# Altium project IR_Communication.PrjPcb
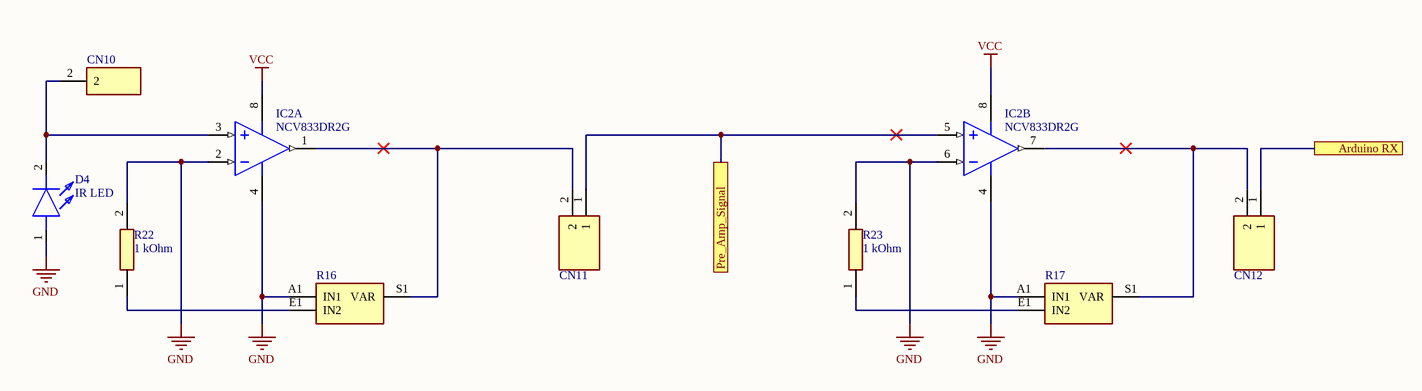
[diagram p0: Pre_Amplifier.SchDoc]
5 sheets, 58 parts. Net scope: flat (ports and power ports of the same name join across sheets).
Board file: IR_Communication.PcbDoc
Sheets:
  Pre_Amplifier.SchDoc
  Amplifier.SchDoc
  Indicators.SchDoc
  Input_Selection.SchDoc
  CPU.SchDoc

## Sheet Pre_Amplifier.SchDoc: Pre Amplifier
size A4; DrawnBy: Sem Kirkels; DocumentNumber: 22-23P01S01; Revision: V1; SheetNumber: 1; SheetTotal: 5

### Parts
CN10  1 Pin Header  [1 PIN HEADER]  (value not drawn)
CN11  2 Pin Header  [2 Pin Header]  (value not drawn)
CN12  2 Pin Header  [2 Pin Header]  (value not drawn)
D4  IR LED  [ELIR204H16L10]
IC2  NCV833DR2G  [Footprint Opamp]  (parts A,B of 2)
R16  PT10LV10-202A2020-S  [Variable resistor]  (value not drawn)
R17  PT10LV10-202A2020-S  [Variable resistor]  (value not drawn)
R22  1 kOhm  [0805]
R23  1 kOhm  [0805]

### Ports
Arduino RX (see CPU[2B]), Pre_Amp_Signal (see Amplifier[1A], Amplifier[1C], Amplifier[2A], Amplifier[2C])

### Nets
GND: D4.1(A) IC2.2(IN1-) IC2.4(VEE) IC2.6(IN2-) R16.A1(IN1) R17.A1(IN1) R22.2 R23.2
VCC: IC2.8(VCC)
NetCN6_2: CN12.1 ; port Arduino RX
NetCN10_2: CN10.2 D4.2(K) IC2.3(IN1+)
NetCN11_1: CN11.1 IC2.5(IN2+) ; port Pre_Amp_Signal
NetCN11_2: CN11.2 IC2.1(OUT1) R16.S1(VAR)
NetCN12_2: CN12.2 IC2.7(OUT2) R17.S1(VAR)
NetR16_E1: R16.E1(IN2) R22.1
NetR17_E1: R17.E1(IN2) R23.1

### Library data of the parts
CN10 = 1 Pin Header: Connector; Manufacturer_Name: TE Connectivity; Manufacturer_Part_Number: 5-146281-1; Datasheet Link: https://www.mouser.com/datasheet/2/418/NG_CD_146281_G1-1238634.pdf; Height: 8.81mm; Mouser Part Number: 571-5-146281-1; Mouser Price/Stock: https://www.mouser.co.uk/ProductDetail/TE-Connectivity/5-146281-1?qs=bwpFY26eRVdQbbdvDiYEig%3D%3D; Arrow Part Number: 5-146281-1; Arrow Price/Stock: https://www.arrow.com/en/products/5-146281-1/te-connectivity
CN11 CN12 = 2 Pin Header: Connector; Manufacturer_Name: TE Connectivity; Manufacturer_Part_Number: 5-146284-2; Datasheet Link: https://componentsearchengine.com/Datasheets/1/5-146284-2.pdf; Height: 8.21mm; Mouser Part Number: 571-5-146284-2; Mouser Price/Stock: https://www.mouser.co.uk/ProductDetail/TE-Connectivity/5-146284-2?qs=26tC0AmtfJgTF4M3cEQgiA%3D%3D; Arrow Part Number: 5-146284-2; Arrow Price/Stock: https://www.arrow.com/en/products/5-146284-2/te-connectivity
D4 = IR LED: LED EL-IR204_H16_L10; Manufacturer_Name: Everlight; Manufacturer_Part_Number: EL-IR204/H16/L10; Datasheet Link: https://www.mouser.de/ProductDetail/Everlight/EL-IR204-H16-L10?qs=vs%252BWWTB4QKYLfZ6uf%2Fu%252B0Q%3D%3D; Height: 7mm; Mouser Part Number: 638-IR204/H16/L10; Mouser Price/Stock: https://www.mouser.co.uk/ProductDetail/Everlight/EL-IR204-H16-L10?qs=vs%252BWWTB4QKYLfZ6uf%2Fu%252B0Q%3D%3D
IC2 = Opamp: Low Noise, Audio Dual Operational Amplifier, -40 to 85 degC, 8-Pin SOIC, Pb-Free, Tape and Reel; Manufacturer: On Semiconductor; SR Typ (V/uS): 7; GBW Typ (MHz): 15; RoHS: TRUE; ComponentLink2URL: http://www.onsemi.cn/pub_link/Collateral/LM833-D.PDF; ComponentLink1Description: Manufacturer URL; ComponentLink3Description: Package Specification; Mounting Technology: Surface Mount; Packing: Tape and Reel; ComponentLink3URL: http://www.onsemi.com/pub_link/Collateral/751-07.PDF; DatasheetVersion: Rev. 6; ComponentLink1URL: http://www.onsemi.com/; PackageDescription: 8-Pin Small Outline Integrated Circuit, Body 4.9 x 3.9 mm, Pitch 1.27 mm; PackageReference: SOIC-8-751-07; PartNumber: NCV833DR2G; PackageVersion: Rev. AK, 02/2011; ComponentLink2Description: Datasheet
R16 R17 = PT10LV10-202A2020-S: Variable Resistor; Manufacturer_Name: PIHER; Datasheet Link: https://www.piher.net/pdf/12-PT10v03.pdf; Height: 6.2mm; Manufacturer_Part_Number: PT10LV10-202A2020-S; Mouser Part Number: 531-PT10V-2K-S; Mouser Price/Stock: https://www.mouser.co.uk/ProductDetail/Amphenol-Piher/PT10LV10-202A2020-S?qs=pCZPOPZMYPhb8H8I5oW3PQ%3D%3D
R22 R23 = Resistor: Manufacturer_Name: YAGEO; Manufacturer_Part_Number: RP0805BRD071KL; Datasheet Link: https://www.yageo.com/upload/media/product/products/datasheet/rchip/PYu-RP_51_RoHS_L_0.pdf; Height: 0.6mm; Mouser Part Number: 603-RP0805BRD071KL; Mouser Price/Stock: https://www.mouser.co.uk/ProductDetail/YAGEO/RP0805BRD071KL?qs=Y0Uzf4wQF3m8mAbG54g63Q%3D%3D

## Sheet Amplifier.SchDoc: Amplifier
size A4; DrawnBy: Sem Kirkels; DocumentNumber: 22-23P01S02; Revision: V1; SheetNumber: 2; SheetTotal: 5
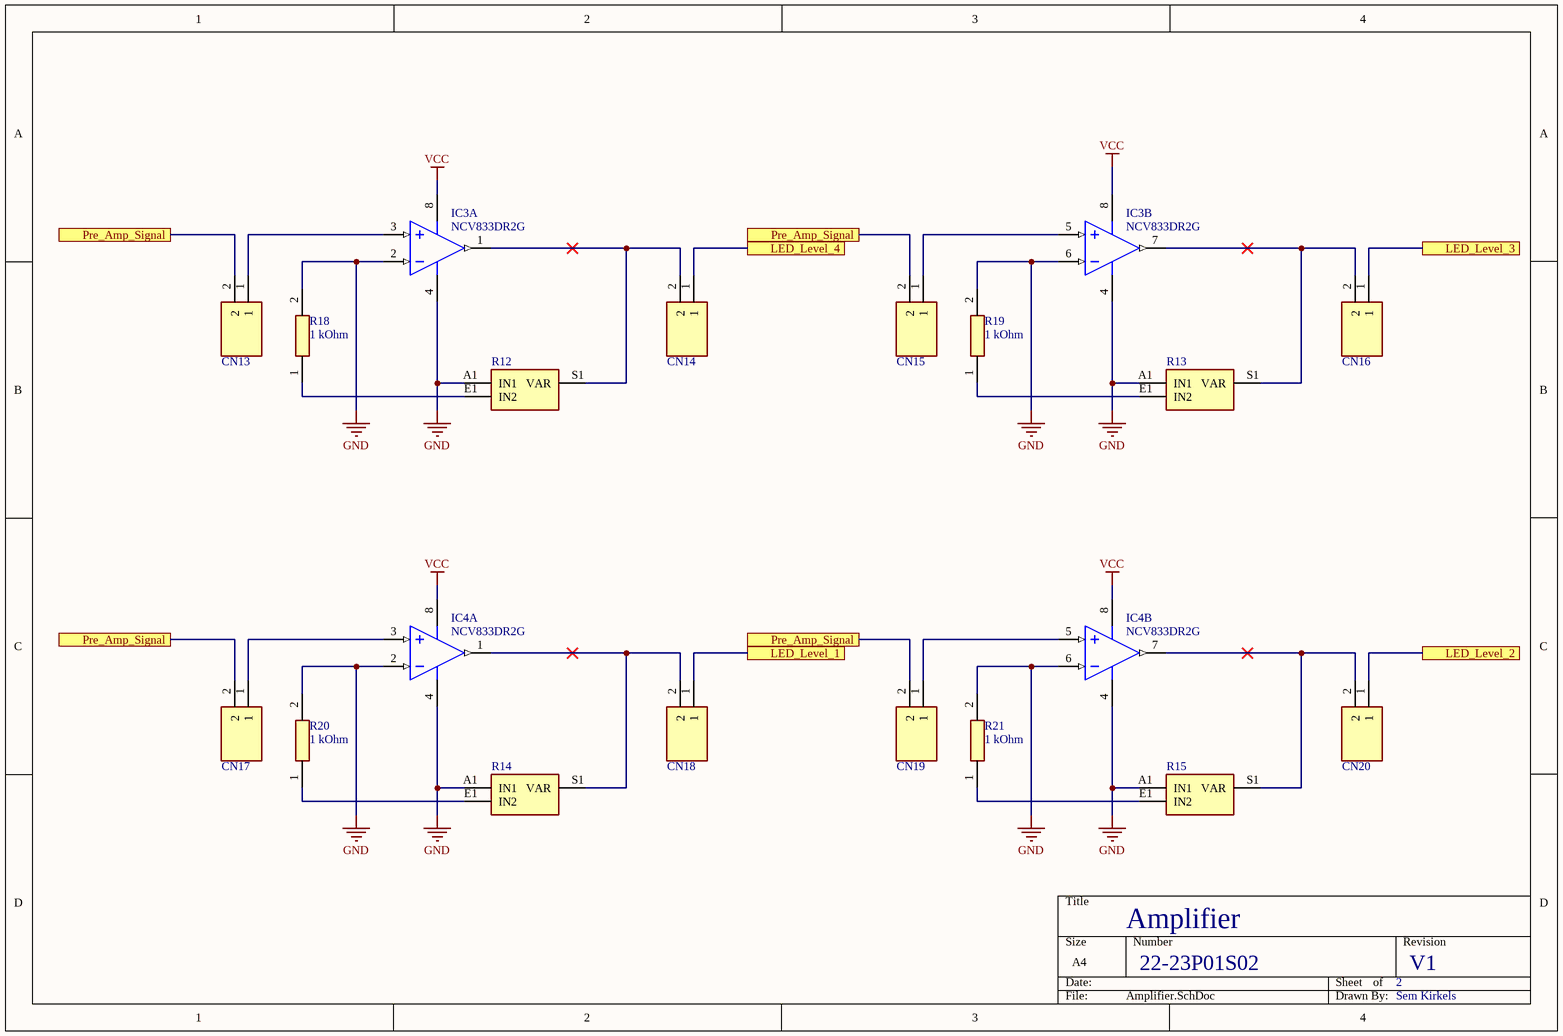
[diagram p1: Amplifier.SchDoc]

### Parts
CN13  2 Pin Header  [2 Pin Header]  (value not drawn)
CN14  2 Pin Header  [2 Pin Header]  (value not drawn)
CN15  2 Pin Header  [2 Pin Header]  (value not drawn)
CN16  2 Pin Header  [2 Pin Header]  (value not drawn)
CN17  2 Pin Header  [2 Pin Header]  (value not drawn)
CN18  2 Pin Header  [2 Pin Header]  (value not drawn)
CN19  2 Pin Header  [2 Pin Header]  (value not drawn)
CN20  2 Pin Header  [2 Pin Header]  (value not drawn)
IC3  NCV833DR2G  [Footprint Opamp]  (parts A,B of 2)
IC4  NCV833DR2G  [Footprint Opamp]  (parts A,B of 2)
R12  PT10LV10-202A2020-S  [Variable resistor]  (value not drawn)
R13  PT10LV10-202A2020-S  [Variable resistor]  (value not drawn)
R14  PT10LV10-202A2020-S  [Variable resistor]  (value not drawn)
R15  PT10LV10-202A2020-S  [Variable resistor]  (value not drawn)
R18  1 kOhm  [0805]
R19  1 kOhm  [0805]
R20  1 kOhm  [0805]
R21  1 kOhm  [0805]

### Ports
LED_Level_1 (see Indicators[2B]), LED_Level_2 (see Indicators[2B]), LED_Level_3 (see Indicators[2B]), LED_Level_4 (see Indicators[2B]), Pre_Amp_Signal (see Amplifier[1A], Amplifier[1C], Amplifier[2A], Pre_Amplifier[3B]), Pre_Amp_Signal (see Amplifier[1A], Amplifier[1C], Amplifier[2C], Pre_Amplifier[3B]), Pre_Amp_Signal (see Amplifier[1A], Amplifier[2A], Amplifier[2C], Pre_Amplifier[3B]), Pre_Amp_Signal (see Amplifier[1C], Amplifier[2A], Amplifier[2C], Pre_Amplifier[3B])

### Nets
GND: IC3.2(IN1-) IC3.4(VEE) IC3.6(IN2-) IC4.2(IN1-) IC4.4(VEE) IC4.6(IN2-) R12.A1(IN1) R13.A1(IN1) R14.A1(IN1) R15.A1(IN1) R18.2 R19.2 R20.2 R21.2
VCC: IC3.8(VCC) IC4.8(VCC)
NetCN11_1: CN13.2 CN15.2 CN17.2 CN19.2 ; port Pre_Amp_Signal
NetCN13_1: CN13.1 IC3.3(IN1+)
NetCN14_1: CN14.1 ; port LED_Level_4
NetCN14_2: CN14.2 IC3.1(OUT1) R12.S1(VAR)
NetCN15_1: CN15.1 IC3.5(IN2+)
NetCN16_1: CN16.1 ; port LED_Level_3
NetCN16_2: CN16.2 IC3.7(OUT2) R13.S1(VAR)
NetCN17_1: CN17.1 IC4.3(IN1+)
NetCN18_1: CN18.1 ; port LED_Level_1
NetCN18_2: CN18.2 IC4.1(OUT1) R14.S1(VAR)
NetCN19_1: CN19.1 IC4.5(IN2+)
NetCN20_1: CN20.1 ; port LED_Level_2
NetCN20_2: CN20.2 IC4.7(OUT2) R15.S1(VAR)
NetR12_E1: R12.E1(IN2) R18.1
NetR13_E1: R13.E1(IN2) R19.1
NetR14_E1: R14.E1(IN2) R20.1
NetR15_E1: R15.E1(IN2) R21.1

### Library data of the parts
CN13-CN20 = 2 Pin Header: as CN11 on sheet Pre_Amplifier; Datasheet Link: https://componentsearchengine.com/Datasheets/1/5-146284-2.pdf; Height: 8.21mm; Mouser Part Number: 571-5-146284-2; Mouser Price/Stock: https://www.mouser.co.uk/ProductDetail/TE-Connectivity/5-146284-2?qs=26tC0AmtfJgTF4M3cEQgiA%3D%3D; Arrow Part Number: 5-146284-2; Arrow Price/Stock: https://www.arrow.com/en/products/5-146284-2/te-connectivity
IC3 IC4 = Opamp: as IC2 on sheet Pre_Amplifier; RoHS: TRUE; ComponentLink2URL: http://www.onsemi.cn/pub_link/Collateral/LM833-D.PDF; ComponentLink1Description: Manufacturer URL; ComponentLink3Description: Package Specification; Mounting Technology: Surface Mount; Packing: Tape and Reel; ComponentLink3URL: http://www.onsemi.com/pub_link/Collateral/751-07.PDF; DatasheetVersion: Rev. 6; ComponentLink1URL: http://www.onsemi.com/; PackageDescription: 8-Pin Small Outline Integrated Circuit, Body 4.9 x 3.9 mm, Pitch 1.27 mm; PackageReference: SOIC-8-751-07; PartNumber: NCV833DR2G; PackageVersion: Rev. AK, 02/2011; ComponentLink2Description: Datasheet
R12-R15 = PT10LV10-202A2020-S: as R16 on sheet Pre_Amplifier; Datasheet Link: https://www.piher.net/pdf/12-PT10v03.pdf; Height: 6.2mm; Manufacturer_Part_Number: PT10LV10-202A2020-S; Mouser Part Number: 531-PT10V-2K-S; Mouser Price/Stock: https://www.mouser.co.uk/ProductDetail/Amphenol-Piher/PT10LV10-202A2020-S?qs=pCZPOPZMYPhb8H8I5oW3PQ%3D%3D
R18-R21 = Resistor: as R22 on sheet Pre_Amplifier; Datasheet Link: https://www.yageo.com/upload/media/product/products/datasheet/rchip/PYu-RP_51_RoHS_L_0.pdf; Height: 0.6mm; Mouser Part Number: 603-RP0805BRD071KL; Mouser Price/Stock: https://www.mouser.co.uk/ProductDetail/YAGEO/RP0805BRD071KL?qs=Y0Uzf4wQF3m8mAbG54g63Q%3D%3D

## Sheet Indicators.SchDoc: Indicators
size A4; DrawnBy: Sem Kirkels; DocumentNumber: 22-23P01S03; Revision: V1; SheetNumber: 3; SheetTotal: 5
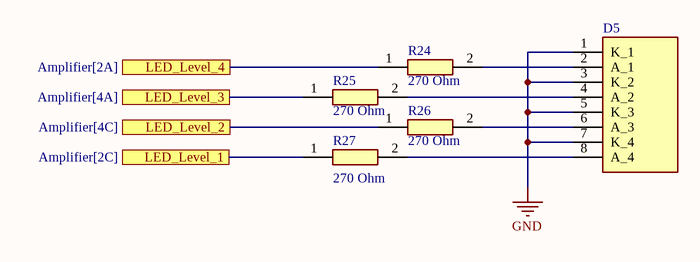
[diagram p2: Indicators.SchDoc]

### Parts
D5  LED Bar  [LED_Bar]  (value not drawn)
R24  270 Ohm  [0805]
R25  270 Ohm  [0805]
R26  270 Ohm  [0805]
R27  270 Ohm  [0805]

### Ports
LED_Level_1 (see Amplifier[2C]), LED_Level_2 (see Amplifier[4C]), LED_Level_3 (see Amplifier[4A]), LED_Level_4 (see Amplifier[2A])

### Nets
GND: D5.1(K_1) D5.3(K_2) D5.5(K_3) D5.7(K_4)
NetCN14_1: R24.1 ; port LED_Level_4
NetCN16_1: R25.1 ; port LED_Level_3
NetCN18_1: R27.1 ; port LED_Level_1
NetCN20_1: R26.1 ; port LED_Level_2
NetD5_2: D5.2(A_1) R24.2
NetD5_4: D5.4(A_2) R25.2
NetD5_6: D5.6(A_3) R26.2
NetD5_8: D5.8(A_4) R27.2

### Library data of the parts
D5 = LED Bar: SSB-LX2550SGW; Manufacturer_Name: Lumex; Datasheet Link: https://www.mouser.fr/datasheet/2/244/SSB-LX2550SGW-1777056.pdf; Height: 7.37mm; Manufacturer_Part_Number: SSB-LX2550SGW; Mouser Part Number: 696-SSB-LX2550SGW; Mouser Price/Stock: https://www.mouser.co.uk/ProductDetail/Lumex/SSB-LX2550SGW?qs=K%252Bxkc0srH7Bp%252B5yK7Wnd0w%3D%3D
R24-R27 = Resistor: as R22 on sheet Pre_Amplifier; Datasheet Link: https://www.yageo.com/upload/media/product/products/datasheet/rchip/PYu-RP_51_RoHS_L_0.pdf; Height: 0.6mm; Mouser Part Number: 603-RP0805BRD071KL; Mouser Price/Stock: https://www.mouser.co.uk/ProductDetail/YAGEO/RP0805BRD071KL?qs=Y0Uzf4wQF3m8mAbG54g63Q%3D%3D

## Sheet Input_Selection.SchDoc: Input Selection
size A4; DrawnBy: Sem Kirkels; DocumentNumber: 22-23P01S04; Revision: V1; SheetNumber: 4; SheetTotal: 5
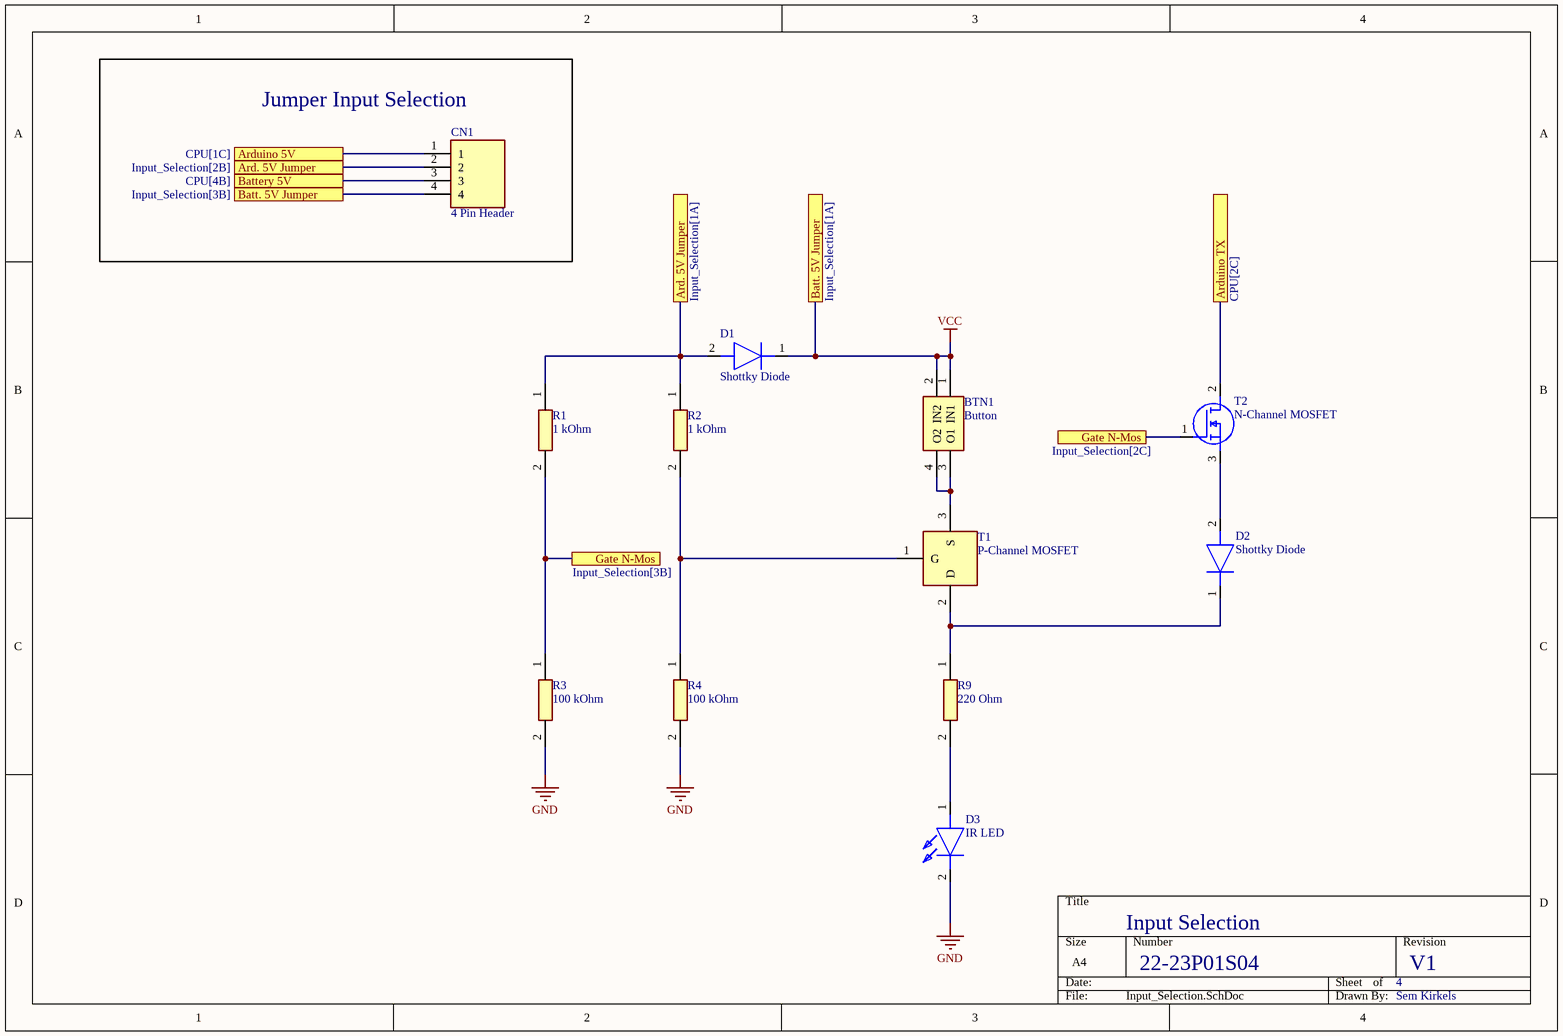
[diagram p3: Input_Selection.SchDoc]

### Parts
BTN1  Button  [PushButton]
CN1  4 Pin Header  [4 PIN HEADER]
D1  Shottky Diode  [Zener Diode]
D2  Shottky Diode  [Zener Diode]
D3  IR LED  [ELIR204H16L10]
R1  1 kOhm  [0805]
R2  1 kOhm  [0805]
R3  100 kOhm  [0805]
R4  100 kOhm  [0805]
R9  220 Ohm  [0805]
T1  P-Channel MOSFET  [TO254P469X1042X1967-3P]
T2  N-Channel MOSFET  [N-MOS]

### Blocks framed on the sheet
Jumper Input Selection: CN1

### Ports
Ard. 5V Jumper (see Input_Selection[1A]), Ard. 5V Jumper (see Input_Selection[2B]), Arduino 5V (see CPU[1C]), Arduino TX (see CPU[2C]), Batt. 5V Jumper (see Input_Selection[1A]), Batt. 5V Jumper (see Input_Selection[3B]), Battery 5V (see CPU[4B]), Gate N-Mos (see Input_Selection[2C]), Gate N-Mos (see Input_Selection[3B])

### Nets
GND: D3.2(K) R3.2 R4.2
VCC: BTN1.1(IN1) BTN1.2(IN2) CN1.4 D1.1(K) ; port Batt. 5V Jumper
NetBTN1_3: BTN1.3(O1) BTN1.4(O2) T1.3(S)
NetCN1_1: CN1.1 ; port Arduino 5V
NetCN1_2: CN1.2 D1.2(A) R1.1 R2.1 ; port Ard. 5V Jumper
NetCN1_3: CN1.3 ; port Battery 5V
NetCN5_2: T2.2(D) ; port Arduino TX
NetD2_1: D2.1(K) R9.1 T1.2(D)
NetD2_2: D2.2(A) T2.3(S)
NetD3_1: D3.1(A) R9.2
NetR1_2: R1.2 R3.1 T2.1(G) ; port Gate N-Mos
NetR2_2: R2.2 R4.1 T1.1(G)

### Library data of the parts
BTN1 = Button: TS02-66-50-BK-100-SCR-D; Manufacturer_Name: CUI Devices; Datasheet Link: https://www.cuidevices.com/product/resource/ts02.pdf; Height: 5.2mm; Manufacturer_Part_Number: TS02-66-50-BK-100-SCR-D; Mouser Part Number: 179-TS026650BK100SCR; Mouser Price/Stock: https://www.mouser.co.uk/ProductDetail/CUI-Devices/TS02-66-50-BK-100-SCR-D?qs=A6eO%252BMLsxmQON%252BZSzpek2A%3D%3D; Arrow Part Number: TS02-66-50-BK-100-SCR-D; Arrow Price/Stock: https://www.arrow.com/en/products/ts02-66-50-bk-100-scr-d/cui-devices?region=nac
CN1 = 4 Pin Header: G800LW304032EU; Manufacturer_Name: Amphenol Communications Solutions; Datasheet Link: https://cdn.amphenol-cs.com/media/wysiwyg/files/drawing/g800lwxxxxxxeu.pdf; Height: 8.63mm; Manufacturer_Part_Number: G800LW304032EU; Mouser Part Number: 523-G800LW304032EU; Mouser Price/Stock: https://www.mouser.com/Search/Refine.aspx?Keyword=523-G800LW304032EU
D1 D2 = Zener Diode: VS-10BQ015-M3_5BT; Manufacturer_Name: Vishay; Manufacturer_Part_Number: VS-10BQ015-M3/5BT; Datasheet Link: https://componentsearchengine.com/Datasheets/2/VS-10BQ015-M3_5BT.pdf; Height: 2.44mm; Mouser Part Number: 78-VS-10BQ015-M35BT; Mouser Price/Stock: https://www.mouser.co.uk/ProductDetail/Vishay-Semiconductors/VS-10BQ015-M3-5BT?qs=asPD7ZL2j3VpzaHhlDLLKA%3D%3D; Arrow Part Number: VS-10BQ015-M3/5BT; Arrow Price/Stock: https://www.arrow.com/en/products/vs-10bq015-m35bt/vishay
D3 = IR LED: as D4 on sheet Pre_Amplifier; Datasheet Link: https://www.mouser.de/ProductDetail/Everlight/EL-IR204-H16-L10?qs=vs%252BWWTB4QKYLfZ6uf%2Fu%252B0Q%3D%3D; Height: 7mm; Mouser Part Number: 638-IR204/H16/L10; Mouser Price/Stock: https://www.mouser.co.uk/ProductDetail/Everlight/EL-IR204-H16-L10?qs=vs%252BWWTB4QKYLfZ6uf%2Fu%252B0Q%3D%3D
R1-R4 R9 = Resistor: as R22 on sheet Pre_Amplifier; Datasheet Link: https://www.yageo.com/upload/media/product/products/datasheet/rchip/PYu-RP_51_RoHS_L_0.pdf; Height: 0.6mm; Mouser Part Number: 603-RP0805BRD071KL; Mouser Price/Stock: https://www.mouser.co.uk/ProductDetail/YAGEO/RP0805BRD071KL?qs=Y0Uzf4wQF3m8mAbG54g63Q%3D%3D
T1 = P-Channel MOSFET: MOSFET (P-Channel)IRF9530NPBF; Manufacturer_Name: Infineon; Datasheet Link: https://www.infineon.com/dgdl/irf9530npbf.pdf?fileId=5546d462533600a401535611b9931dc1; Height: 4.69mm; Manufacturer_Part_Number: IRF9530NPBF; Mouser Part Number: 942-IRF9530NPBF; Mouser Price/Stock: https://www.mouser.co.uk/ProductDetail/Infineon-Technologies/IRF9530NPBF?qs=9%252BKlkBgLFf2oWmEcBf5aZQ%3D%3D; Arrow Part Number: IRF9530NPBF; Arrow Price/Stock: https://www.arrow.com/en/products/irf9530npbf/infineon-technologies-ag?region=europe
T2 = N-Channel MOSFET: MOSFET (N-Channel)IRF540NPBF; Manufacturer_Name: Infineon; Datasheet Link: https://www.infineon.com/dgdl/irf540n.pdf?fileId=5546d462533600a4015355e396cb199f; Height: 4.69mm; Manufacturer_Part_Number: IRF540NPBF; Mouser Part Number: 942-IRF540NPBF; Mouser Price/Stock: https://www.mouser.co.uk/ProductDetail/Infineon-Technologies/IRF540NPBF?qs=9%252BKlkBgLFf36us%252Bg5kwffA%3D%3D; Arrow Part Number: IRF540NPBF; Arrow Price/Stock: https://www.arrow.com/en/products/irf540npbf/infineon-technologies-ag?region=europe

## Sheet CPU.SchDoc: CPU
size A4; DrawnBy: Axel Vanherle, Nathan Bruggeman; DocumentNumber: 22-23P01S05; Revision: V1; SheetNumber: 5; SheetTotal: 5
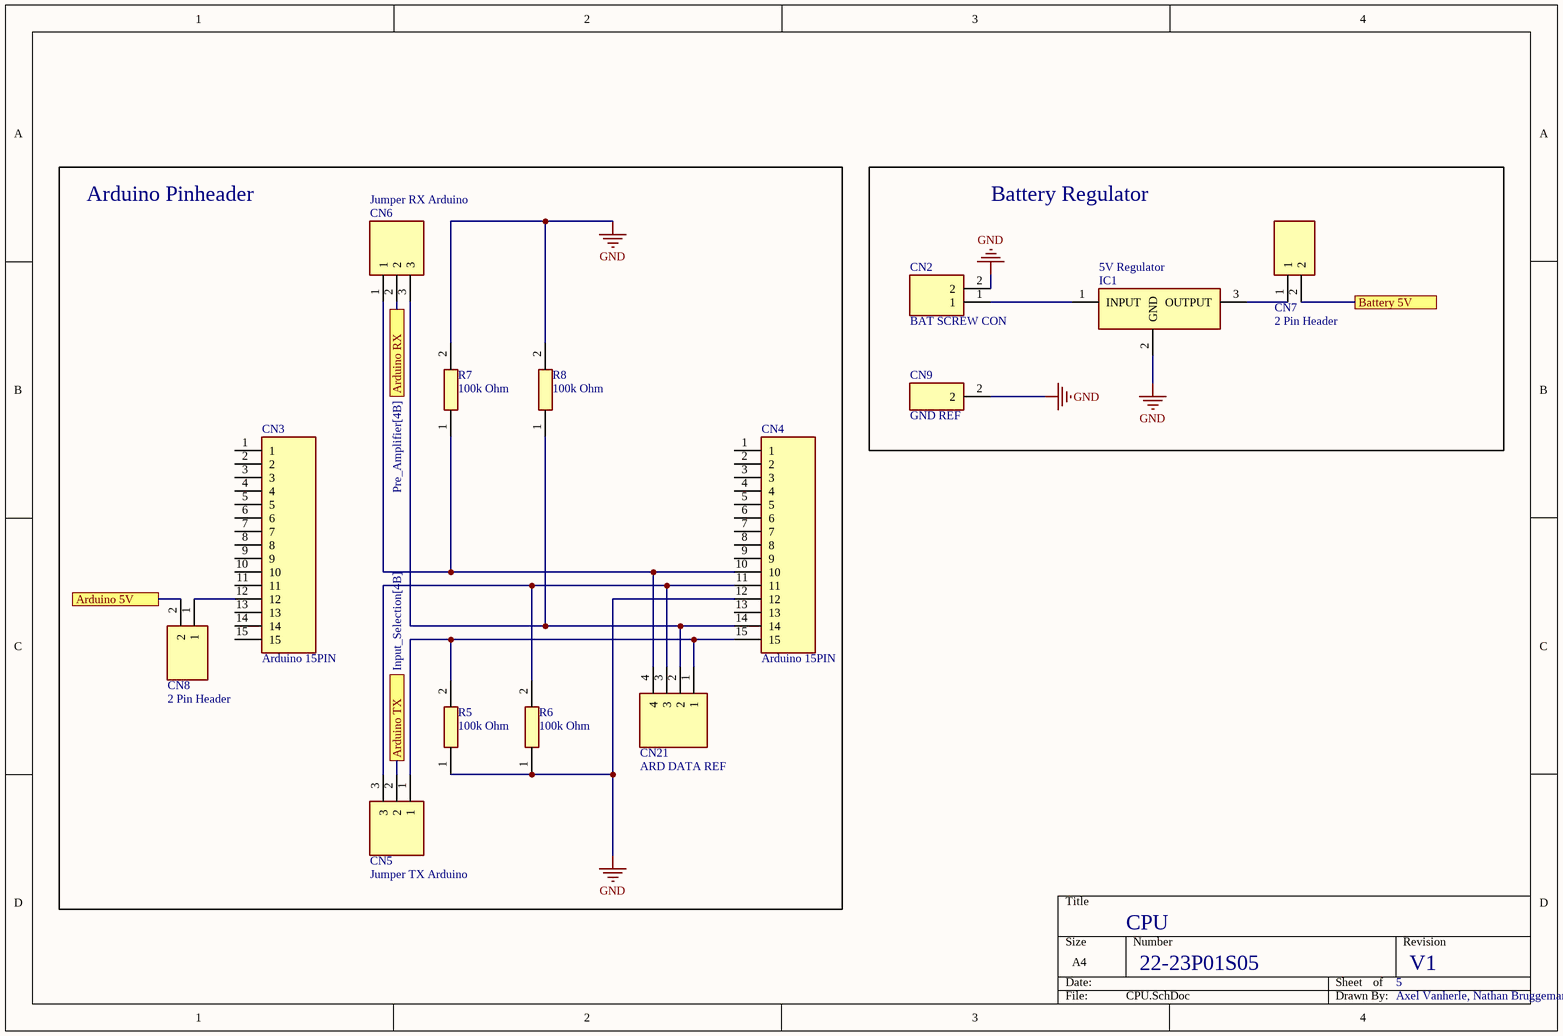
[diagram p4: CPU.SchDoc]

### Parts
CN2  BAT SCREW CON  [BAT SCREW CON]
CN3  Arduino 15PIN  [15 Pin Header]
CN4  Arduino 15PIN  [15 Pin Header]
CN5  Jumper TX Arduino  [3 Pin Header]
CN6  Jumper RX Arduino  [3 Pin Header]
CN7  2 Pin Header  [2 Pin Header]
CN8  2 Pin Header  [2 Pin Header]
CN9  GND REF  [1 PIN HEADER]
CN21  ARD DATA REF  [4 PIN HEADER]
IC1  5V Regulator  [5V Regulator]
R5  100k Ohm  [0805]
R6  100k Ohm  [0805]
R7  100k Ohm  [0805]
R8  100k Ohm  [0805]

### Blocks framed on the sheet
Arduino Pinheader: CN3-CN6 CN8 CN21 R5-R8
Battery Regulator: CN2 CN7 CN9 IC1

### Ports
Arduino 5V (see Input_Selection[1A]), Arduino RX (see Pre_Amplifier[4B]), Arduino TX (see Input_Selection[4B]), Battery 5V (see Input_Selection[1A])

### Nets
GND: CN2.2 CN4.12 CN9.2 IC1.2(GND) R5.1 R6.1 R7.2 R8.2
NetCN1_1: CN8.2 ; port Arduino 5V
NetCN1_3: CN7.2 ; port Battery 5V
NetCN2_1: CN2.1 IC1.1(INPUT)
NetCN3_12: CN3.12 CN8.1
NetCN4_10: CN4.10 CN6.1 CN21.4 R7.1
NetCN4_11: CN4.11 CN5.3 CN21.3 R6.2
NetCN4_14: CN4.14 CN6.3 CN21.2 R8.1
NetCN4_15: CN4.15 CN5.1 CN21.1 R5.2
NetCN5_2: CN5.2 ; port Arduino TX
NetCN6_2: CN6.2 ; port Arduino RX
NetCN7_1: CN7.1 IC1.3(OUTPUT)

Not connected (* = marked no-connect by the designer): CN3 1 2 3 4 5 6 7 8 9 10 11 13 14 15; CN4 1 2 3 4 5 6 7 8 9 13

### Library data of the parts
CN2 = BAT SCREW CON: Connector; Manufacturer_Name: CUI Devices; Manufacturer_Part_Number: TB006-508-02BE; Datasheet Link: https://datasheet.datasheetarchive.com/originals/distributors/Datasheets_SAMA/b266c411a02422edb513b788238f8420.pdf; Height: 10.4mm; Mouser Part Number: 490-TB006-508-02BE; Mouser Price/Stock: https://www.mouser.co.uk/ProductDetail/CUI-Devices/TB006-508-02BE?qs=vLWxofP3U2wEdOVV%2FaT04w%3D%3D; Arrow Part Number: TB006-508-02BE; Arrow Price/Stock: https://www.arrow.com/en/products/tb006-508-02be/cui-devices?region=nac
CN3 CN4 = 15 Pin Header: 15 Pin Header Connector; Manufacturer_Name: SparkFun; Manufacturer_Part_Number: PRT-16279; Datasheet Link: https://cdn.sparkfun.com/assets/8/d/8/4/7/DS-16279-Arduino_Nano_Stackable_Header_Kit.pdf; Height: 8.65mm; Mouser Part Number: 474-PRT-16279; Mouser Price/Stock: https://www.mouser.co.uk/ProductDetail/SparkFun/PRT-16279?qs=vmHwEFxEFR8I6W1vfufYPg%3D%3D; Arrow Part Number: PRT-16279; Arrow Price/Stock: https://www.arrow.com/en/products/prt-16279/sparkfun-electronics?region=nac
CN5 CN6 = 3 Pin Header: TSW-103-07-G-S; Manufacturer_Name: SAMTEC; Datasheet Link: http://suddendocs.samtec.com/prints/tsw-xxx-xx-xxx-x-xx-xxx-mkt.pdf; Manufacturer_Part_Number: TSW-103-07-G-S; Mouser Part Number: 200-TSW10307GS; Mouser Price/Stock: https://www.mouser.co.uk/ProductDetail/Samtec/TSW-103-07-G-S?qs=iT52DjcXudtntd1jApTIAw%3D%3D; Arrow Part Number: TSW-103-07-G-S; Arrow Price/Stock: https://www.arrow.com/en/products/tsw-103-07-g-s/samtec?region=europe
CN7 CN8 = 2 Pin Header: as CN11 on sheet Pre_Amplifier; Datasheet Link: https://componentsearchengine.com/Datasheets/1/5-146284-2.pdf; Height: 8.21mm; Mouser Part Number: 571-5-146284-2; Mouser Price/Stock: https://www.mouser.co.uk/ProductDetail/TE-Connectivity/5-146284-2?qs=26tC0AmtfJgTF4M3cEQgiA%3D%3D; Arrow Part Number: 5-146284-2; Arrow Price/Stock: https://www.arrow.com/en/products/5-146284-2/te-connectivity
CN9 = 1 Pin Header: as CN10 on sheet Pre_Amplifier; Datasheet Link: https://www.mouser.com/datasheet/2/418/NG_CD_146281_G1-1238634.pdf; Height: 8.81mm; Mouser Part Number: 571-5-146281-1; Mouser Price/Stock: https://www.mouser.co.uk/ProductDetail/TE-Connectivity/5-146281-1?qs=bwpFY26eRVdQbbdvDiYEig%3D%3D; Arrow Part Number: 5-146281-1; Arrow Price/Stock: https://www.arrow.com/en/products/5-146281-1/te-connectivity
CN21 = 4 Pin Header: as CN1 on sheet Input_Selection; Datasheet Link: https://cdn.amphenol-cs.com/media/wysiwyg/files/drawing/g800lwxxxxxxeu.pdf; Height: 8.63mm; Manufacturer_Part_Number: G800LW304032EU; Mouser Part Number: 523-G800LW304032EU; Mouser Price/Stock: https://www.mouser.com/Search/Refine.aspx?Keyword=523-G800LW304032EU
IC1 = 5V Regulator: MC7805BDTG; Manufacturer_Name: onsemi; Datasheet Link: https://www.onsemi.com/pub/Collateral/MC7800-D.PDF; Height: 2.38mm; Manufacturer_Part_Number: MC7805BDTG; Mouser Part Number: 863-MC7805BDTG; Mouser Price/Stock: https://www.mouser.co.uk/ProductDetail/onsemi/MC7805BDTG?qs=%252B9%2Fcbd0IE0TYE8BQQ8My5g%3D%3D; Arrow Part Number: MC7805BDTG; Arrow Price/Stock: https://www.arrow.com/en/products/mc7805bdtg/on-semiconductor?region=europe
R5-R8 = Resistor: as R22 on sheet Pre_Amplifier; Datasheet Link: https://www.yageo.com/upload/media/product/products/datasheet/rchip/PYu-RP_51_RoHS_L_0.pdf; Height: 0.6mm; Mouser Part Number: 603-RP0805BRD071KL; Mouser Price/Stock: https://www.mouser.co.uk/ProductDetail/YAGEO/RP0805BRD071KL?qs=Y0Uzf4wQF3m8mAbG54g63Q%3D%3D

## Nets that join several sheets
GND: Pre_Amplifier (8 pins), Amplifier (14 pins), Indicators (D5.1 D5.3 D5.5 D5.7), Input_Selection (D3.2 R3.2 R4.2), CPU (8 pins)
VCC: Pre_Amplifier (IC2.8), Amplifier (IC3.8 IC4.8), Input_Selection (BTN1.1 BTN1.2 CN1.4 D1.1)
NetCN1_1: Input_Selection (CN1.1), CPU (CN8.2)
NetCN1_3: Input_Selection (CN1.3), CPU (CN7.2)
NetCN5_2: Input_Selection (T2.2), CPU (CN5.2)
NetCN6_2: Pre_Amplifier (CN12.1), CPU (CN6.2)
NetCN11_1: Pre_Amplifier (CN11.1 IC2.5), Amplifier (CN13.2 CN15.2 CN17.2 CN19.2)
NetCN14_1: Amplifier (CN14.1), Indicators (R24.1)
NetCN16_1: Amplifier (CN16.1), Indicators (R25.1)
NetCN18_1: Amplifier (CN18.1), Indicators (R27.1)
NetCN20_1: Amplifier (CN20.1), Indicators (R26.1)